# Altium schematic sheet HEADER.SchDoc: iCEVision - Headers
size A4; Organization: DPControl srl; Address1: via Napoli, 55; Address2: 84014 - Nocera Inf.re; Address3: Salerno; Address4: Italy; Revision: 1; SheetNumber: 3; SheetTotal: 3
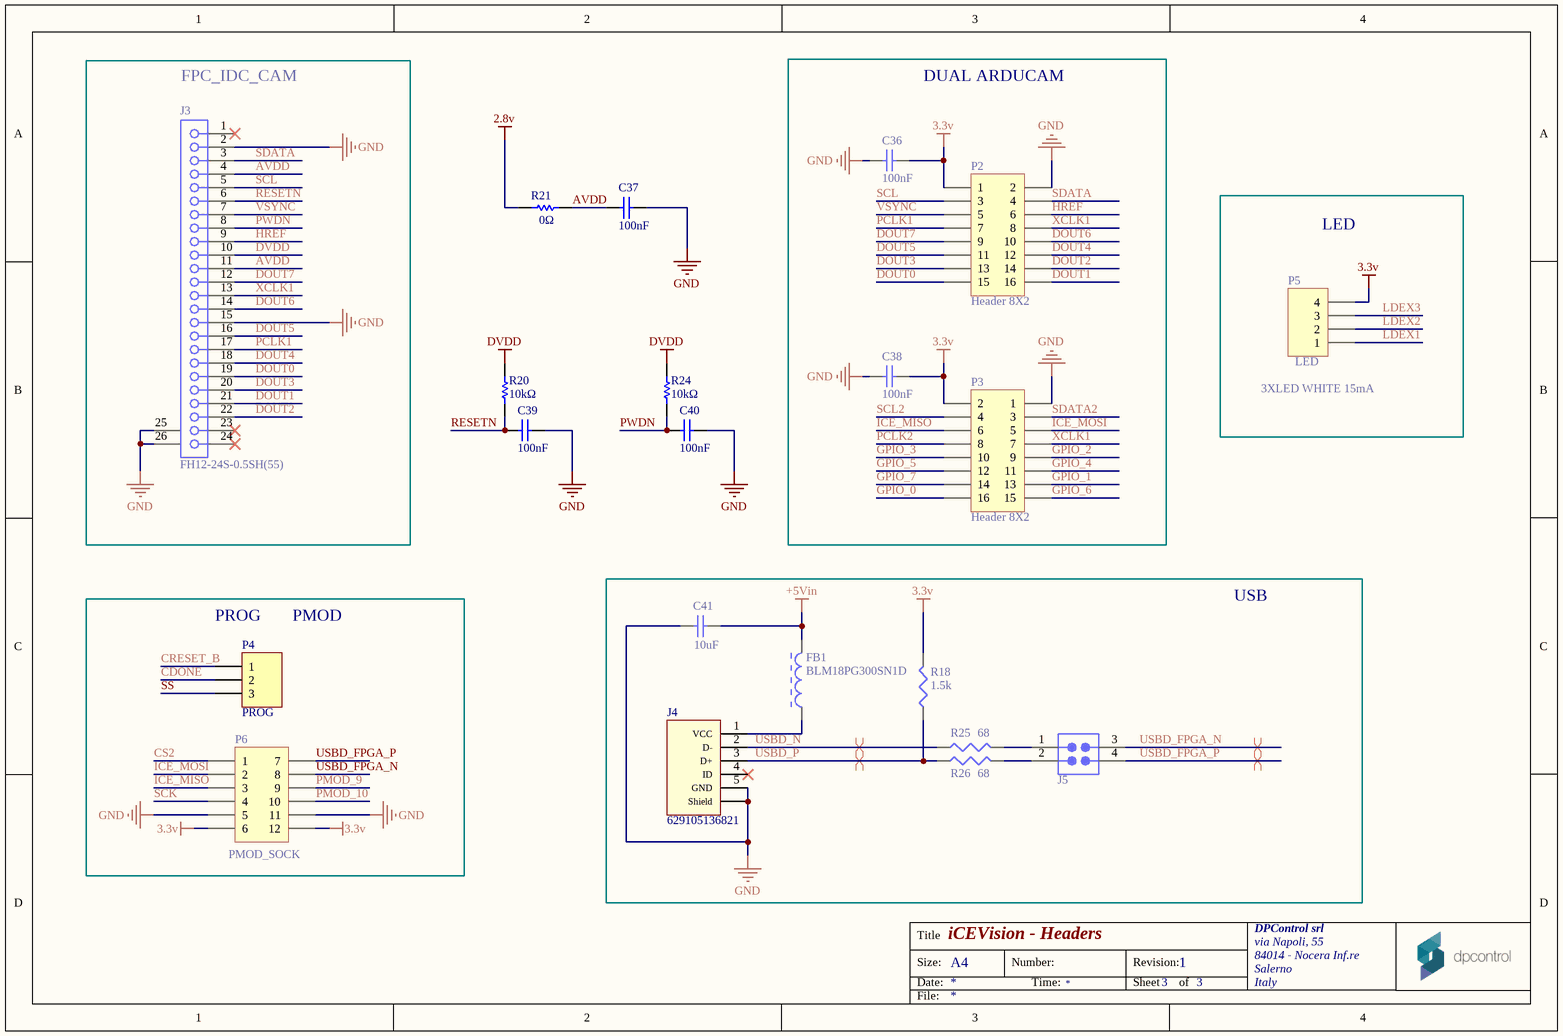
[diagram p0: HEADER.SchDoc]

## Parts
C36  value 100nF  [0603]  (hidden comment: C0603)
C37  value 100nF  [0603]  (hidden comment: C0603)
C38  value 100nF  [0603]  (hidden comment: C0603)
C39  value 100nF  [0603]  (hidden comment: C0603)
C40  value 100nF  [0603]  (hidden comment: C0603)
C41  value 10uF  [C1206]  (hidden comment: Cap Semi)
FB1  BLM18PG300SN1D  [MURA-BLM18PG_KG-CHIP-2_V1]
J3  FH12-24S-0.5SH(55)  [FH12-24S-0.5SH]
J4  629105136821  [629105136821]
J5  WE-2.54 mm Pin Header & Jumper 61300421121  [61300421121]  (value not drawn)
P2  Header 8X2  [HDR2X8]
P3  Header 8X2  [HDR2X8]
P4  PROG  [HDR1X3]
P5  LED  [MHDR1X4]
P6  PMOD_SOCK  [HDR2X6_CEN]
R18  value 1.5k  [J1-0603]  (hidden comment: Res3)
R20  value 10kΩ  [3-0603]  (hidden comment: ERJ3EK)
R21  value 0Ω  [3-0603]  (hidden comment: ERJ3EK)
R24  value 10kΩ  [3-0603]  (hidden comment: ERJ3EK)
R25  value 68  [J1-0603]  (hidden comment: Res3)
R26  value 68  [J1-0603]  (hidden comment: Res3)

## Blocks framed on the sheet
FPC_IDC_CAM: J3
DUAL ARDUCAM: C36 C38 P2 P3
LED: P5
PROG       PMOD: P4 P6
USB: C41 FB1 J4 J5 R18 R25 R26

## Nets
2.8v: R21.1
3.3v: C36.1 C38.1 P2.1 P3.2 P5.4 P6.6 P6.12 R18.2
+5Vin: C41.2 FB1.2
DVDD: J3.10 R20.2 R24.2
GND: C36.2 C37.1 C38.2 C39.1 C40.1 C41.1 J3.2 J3.15 J3.25(MH1) J3.26(MH2) J4.5(GND) J4.Shell(Shield) P2.2 P3.1 P6.5 P6.11
AVDD: C37.2 J3.4 J3.11 R21.2
CDONE: P4.2
CRESET_B: P4.1
CS2: P6.1
DOUT0: J3.19 P2.15
DOUT1: J3.21 P2.16
DOUT2: J3.22 P2.14
DOUT3: J3.20 P2.13
DOUT4: J3.18 P2.12
DOUT5: J3.16 P2.11
DOUT6: J3.14 P2.10
DOUT7: J3.12 P2.9
GPIO_0: P3.16
GPIO_1: P3.13
GPIO_2: P3.9
GPIO_3: P3.10
GPIO_4: P3.11
GPIO_5: P3.12
GPIO_6: P3.15
GPIO_7: P3.14
HREF: J3.9 P2.6
ICE_MISO: P3.6 P6.3
ICE_MOSI: P3.5 P6.2
LDEX1: P5.1
LDEX2: P5.2
LDEX3: P5.3
PCLK1: J3.17 P2.7
PCLK2: P3.8
PMOD_9: P6.9
PMOD_10: P6.10
PWDN: C40.2 J3.8 R24.1
RESETN: C39.2 J3.6 R20.1
SCK: P6.4
SCL: J3.5 P2.3
SCL2: P3.4
SDATA: J3.3 P2.4
SDATA2: P3.3
SS: P4.3
USBD_FPGA_N: J5.3 P6.8
USBD_FPGA_P: J5.4 P6.7
USBD_N: J4.2(D-) R25.1
USBD_P: J4.3(D+) R18.1 R26.1
VSYNC: J3.7 P2.5
XCLK1: J3.13 P2.8 P3.7
NetFB1_1: FB1.1 J4.1(VCC)
NetJ5_1: J5.1 R25.2
NetJ5_2: J5.2 R26.2

Not connected (* = marked no-connect by the designer): J3 1* 23* 24*; J4 4(ID)*

## Layout directives
differential pair: USBD_FPGA_N, USBD_FPGA_P, USBD_N, USBD_P

## Notes on the sheet
- (near P5) 3XLED WHITE 15mA
- Title
- Size:
- Date:
- A4
- Number:
- Time:
- Revision:
- Sheet
- of
- File:

## Library data of the parts
C36-C40 = C0603: Ceramic Chip Capacitor - Standard; Part No: C0603C104K8RACTU; MPN: GPC0603104; Note: Footprint corresponds to dimensions for bulk cassette packaging. This case size has tightened tolerances.; Published: 17-Jul-2002; LatestRevisionNote: Silkscreen size reduced.; DatasheetDocument: Mar-2001; PackageDocument: Mar-2001; PackageReference: 0603; Publisher: Altium Limited; Code_JEITA: 0603; Code_IPC: 1608 [0603]; ComponentLink1Description: Manufacturer Link; ComponentLink1URL: http://www.kemet.com/; ComponentLink2Description: Datasheet; ComponentLink2URL: http://www.kemet.com/kemet/web/homepage/kechome.nsf/vapubfilesname/F3102TA.pdf/$file/F3102TA.pdf
C41 = Cap Semi: Capacitor (Semiconductor SIM Model); MPN: 1206ZD106KAT2A; Published: 8-Jun-2000; LatestRevisionDate: 29-May-2009; LatestRevisionNote: IPC-7351 Footprint Added.; PackageReference: C1206; Publisher: Altium Limited; PackageDescription: Chip Capacitor
FB1 = CMP-0686-00572-2: Chip Ferrite Bead for Power Lines, 30 Ohm, 1000 mA, -55 to 125 degC, 1.6 x 0.8 x 0.95 mm SMD, Tape and Reel; Manufacturer: Murata; DC Resistance: 0.05 Ohm Max.; Impedance (at 100 MHz): 30 Ohm Typ.; Rated Current: 1000 mA; ComponentLink1Description: Manufacturer URL; Packing: Tape and Reel; ComponentLink2URL: http://www.murata.com/products/catalog/pdf/c31e.pdf; DatasheetVersion: 08/2013; PartNumber: BLM18PG300SN1D; Mounting Technology: Surface Mount; ComponentLink2Description: Datasheet; PackageReference: BLM18_H950-2; Operating Temperature Range: -55 to 125 degC; ComponentLink3Description: Package Specification; PackageDescription: 2-Pin Chip, Body 1.6 x 0.8 mm; ComponentLink1URL: http://www.murata.com/; ComponentLink3URL: http://www.murata.com/products/catalog/pdf/c31e.pdf; MPN: BLM18PG300SN1D
J3 = CL586-0521-0: FH12 Series, "Flip-Lock" SMT/ZIF FFC/FPC Connector - 0.5mm Spaced Bottom Contact; MPN: FH12A-24S-0.5SH(55); Positions: 24; ContactMaterial: Phosphor Bronze; Current: 0.4A; PCB_Layout: Complies with manufacturer's recommendation.; Published: 17-Jul-2002; DatasheetVersion: 13-Nov-2000; PackageVersion: 13-Nov-2000; PackageReference: FH12-24S-0.5SH; Publisher: Altium Limited; PadDimensions: Follow nominal values, Suitable for Wave Soldering, Adjust for Re-flow.; ComponentLink1Description: Manufacturer Link; ComponentLink1URL: http://www.hiroseusa.com/; ComponentLink2Description: Datasheet; ComponentLink2URL: http://www.hirose.co.jp/cataloge_hp/e58605370.pdf
J4 = 629105136821: Micro USB 2.0 SMT Type B Horizontal 5 Contacts WR-COM; Interface Type: Type B; Gender: Receptacle; ComponentLink1Description: Manufacturer; ComponentLink1URL: http://www.we-online.de; ComponentLink2Description: Datasheet; ComponentLink2URL: http://katalog.we-online.de/em/datasheet/629105136821.pdf; Part Number: 629105136821; Published Date: April 2017; Publisher: Wurth Elektronik; Sub-Family: Micro USB 2.0; Type: Horizontal; Construction: SMT; MPN: 629105136821
J5 = WE-2.54 mm Pin Header & Jumper 61300421121: WR-PHD 2.54 mm Dual Pin Header; Manufacturer: W¨¹rth Elektronik eiSos GmbH; ComponentLink1 Description: Manufacturer; ComponentLink2 Description: Datasheet; NoPins: 04; Created Date: 25 March 2013; partNo: 61300421121; ComponentLink1URL: http://www.we-online.com; ComponentLink2URL: http://katalog.we-online.de/em/datasheet/6130xx21121.pdf; Created by: Karrer Zheng
P2 P3 = Header 8X2: Header, 8-Pin, Dual row; LatestRevisionDate: 17-Jul-2002; LatestRevisionNote: Re-released for DXP Platform.; Publisher: Altium Limited
P4 = Header 3: Header, 3-Pin; LatestRevisionDate: 17-Jul-2002; LatestRevisionNote: Re-released for DXP Platform.; Publisher: Altium Limited
P5 = MHDR1X4: Header, 4-Pin; LatestRevisionDate: 17-Jul-2002; LatestRevisionNote: Re-released for DXP Platform.; Publisher: Altium Limited
P6 = Header 6X2A: Header, 6-Pin, Dual row; LatestRevisionDate: 17-Jul-2002; LatestRevisionNote: Re-released for DXP Platform.; Publisher: Altium Limited; Supplier 1: Digi-Key; Supplier Part Number 1: WM8236-ND
R18 = Res3: Resistor; MPN: GPR06031K5; Published: 8-Jun-2000; LatestRevisionDate: 29-May-2009; LatestRevisionNote: IPC-7351 Footprint Added.; PackageReference: J1-0603; Publisher: Altium Limited; PackageDescription: Chip Resistor
R20 R24 = ERJ3EK: Precision Thick Film Chip Resistor, 10 Ohm to 1M Ohm Range, 1% and 0.5% Tolerance, 0603 Size, 0.063 W; Part No: ERJ3EKF1002V; MPN: GPR060310K; Published: 17-Dec-2003; LatestRevisionDate: 19-Mar-2004; LatestRevisionNote: Silkscreen size reduced.; PackageDocument: Mar-2003; PackageReference: 3-0603; Publisher: Altium Limited; Code_IPC: 1608 [0603]; ComponentLink1Description: Manufacturer Link; ComponentLink1URL: http://www.panasonic.com/industrial/components/resistive_products.htm; ComponentLink2Description: Datasheet; ComponentLink2URL: http://www.panasonic.com/industrial/components/pdf/AOA0000CE2.pdf
R21 = ERJ3EK: Precision Thick Film Chip Resistor, 10 Ohm to 1M Ohm Range, 1% and 0.5% Tolerance, 0603 Size, 0.063 W; Part No: ERJ3GEY0R00V; MPN: CRCW06030000Z0EA; Published: 17-Dec-2003; LatestRevisionDate: 19-Mar-2004; LatestRevisionNote: Silkscreen size reduced.; PackageDocument: Mar-2003; PackageReference: 3-0603; Publisher: Altium Limited; Code_IPC: 1608 [0603]; ComponentLink1Description: Manufacturer Link; ComponentLink1URL: http://www.panasonic.com/industrial/components/resistive_products.htm; ComponentLink2Description: Datasheet; ComponentLink2URL: http://www.panasonic.com/industrial/components/pdf/AOA0000CE2.pdf
R25 R26 = Res3: Resistor; MPN: GPR060368R; Published: 8-Jun-2000; LatestRevisionDate: 29-May-2009; LatestRevisionNote: IPC-7351 Footprint Added.; PackageReference: J1-0603; Publisher: Altium Limited; PackageDescription: Chip Resistor